# Altium schematic sheet 3.3v通信板.SchDoc
size 381 x 406 mm; SheetNumber: 0; SheetTotal: 0
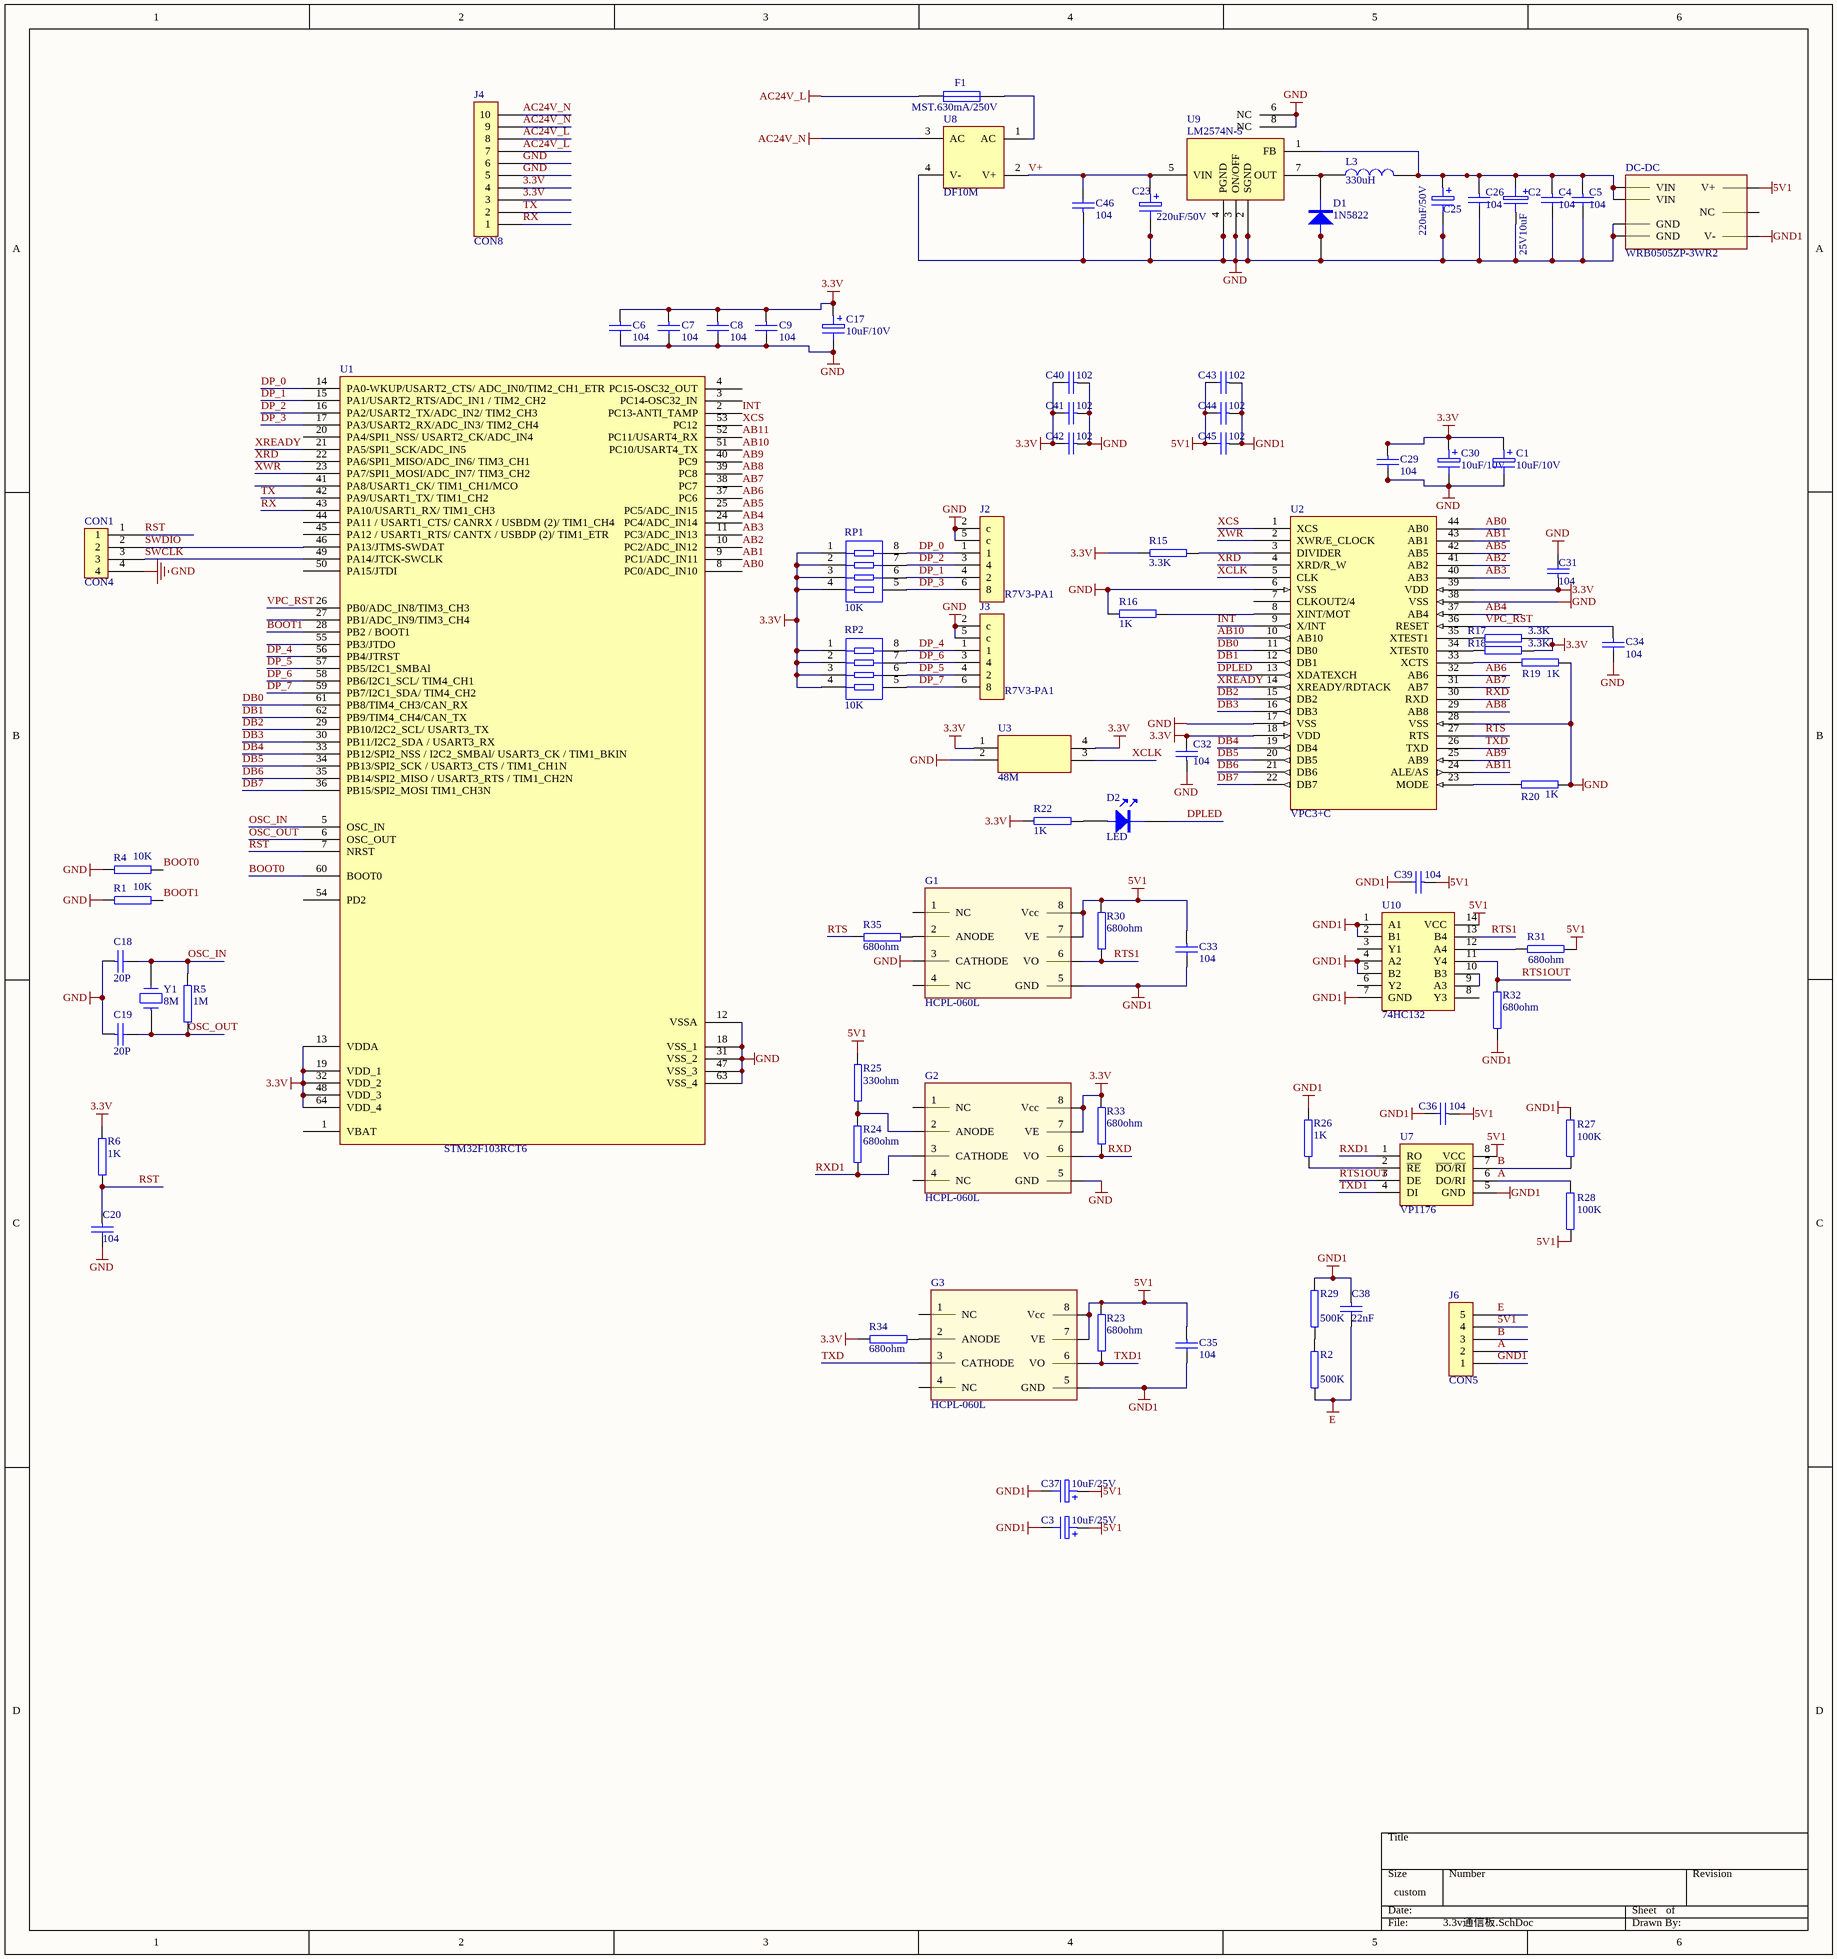
[diagram p0: 3.3v通信板.SchDoc]

## Parts
C1  10uF/10V  [C-坦电容]
C2  25V10uF  [C-坦电容]
C3  10uF/25V  [C-坦电容]
C4  104  [CR0805]
C5  104  [CR0805]
C6  104  [0603]
C7  104  [0603]
C8  104  [0603]
C9  104  [0603]
C17  10uF/10V  [C-坦电容]
C18  20P  [0603]
C19  20P  [0603]
C20  104  [0603]
C23  220uF/50V  [CAP - duplicate]
C25  220uF/50V  [CAP - duplicate]
C26  104  [CR0805]
C29  104  [0603]
C30  10uF/10V  [C-坦电容]
C31  104  [0603]
C32  104  [0603]
C33  104  [0805]
C34  104  [0603]
C35  104  [CR0805]
C36  104  [CR0805]
C37  10uF/25V  [C-坦电容]
C38  22nF  [CAP]
C39  104  [CR0805]
C40  102  [CR0805]
C41  102  [CR0805]
C42  102  [CR0805]
C43  102  [CR0805]
C44  102  [CR0805]
C45  102  [CR0805]
C46  104  [CR0805]
CON1  CON4  [4PIN]
D1  1N5822  [SWDD]
D2  LED  [TLED]
DC-DC  WRB0505ZP-3WR2  [WRB0505ZP-3WR2]
F1  MST.630mA/250V  [RAD0.2]
G1  HCPL-060L  [SO8]
G2  HCPL-060L  [SO8]
G3  HCPL-060L  [SO8]
J2  R7V3-PA1  [R7V3-PA1-CE]
J3  R7V3-PA1  [R7V3-PA1-CE]
J4  CON8  [CON10]
J6  CON5  [3.96-5T]
L3  330uH  [PL]
R1  10K  [0603]
R2  500K  [TGR]
R4  10K  [0603]
R5  1M  [0603]
R6  1K  [0603]
R15  3.3K  [0603]
R16  1K  [0603]
R17  3.3K  [0603]
R18  3.3K  [0603]
R19  1K  [0603]
R20  1K  [0603]
R22  1K  [0603]
R23  680ohm  [CR0805]
R24  680ohm  [CR0805]
R25  330ohm  [CR0805]
R26  1K  [CR0805]
R27  100K  [CR0805]
R28  100K  [CR0805]
R29  500K  [TGR]
R30  680ohm  [CR0805]
R31  680ohm  [CR0805]
R32  680ohm  [CR0805]
R33  680ohm  [CR0805]
R34  680ohm  [CR0805]
R35  680ohm  [CR0805]
RP1  10K  [RESPACK4A]
RP2  10K  [RESPACK4A]
U1  STM32F103RCT6  [LQFP64]
U2  VPC3+C  [VPC3]
U3  48M  [CRYSTAL-48M]
U7  VP1176  [SO8]
U8  DF10M  [BRIGDE_RECTIFIER]
U9  LM2574N-5  [DIP-8]
U10  74HC132  [SO-14]
Y1  8M  [TX]

## Nets
3.3V: C1.1 C6.1 C7.1 C8.1 C9.1 C17.1 C29.1 C30.1 C31.1 C32.2 C40.2 C41.2 C42.2 G2.7(VE) G2.8(Vcc) J4.3 J4.4 R6.2 R15.2 R17.1 R18.1 R22.2 R33.1 R34.1 RP1.1 RP1.2 RP1.3 RP1.4 RP2.1 RP2.2 RP2.3 RP2.4 U1.13(VDDA) U1.19(VDD_1) U1.32(VDD_2) U1.48(VDD_3) U1.64(VDD_4) U2.18(VDD) U2.39(VDD) U3.1 U3.4
5V1: C3.1 C33.1 C35.1 C36.1 C37.1 C39.1 C43.2 C44.2 C45.2 DC-DC.14(V+) G1.7(VE) G1.8(Vcc) G3.7(VE) G3.8(Vcc) J6.4 R23.1 R25.1 R28.1 R30.1 R31.1 U7.8(VCC) U10.14(VCC)
AC24V_L: F1.1 J4.7 J4.8
AC24V_N: J4.9 J4.10 U8.3(AC)
E: C38.2 J6.5 R2.1
GND: C1.2 C2.2 C4.2 C5.2 C6.2 C7.2 C8.2 C9.2 C17.2 C18.1 C19.1 C20.2 C23.2 C25.2 C26.2 C29.2 C30.2 C31.2 C32.1 C34.2 C40.1 C41.1 C42.1 C46.1 CON1.4 D1.1 DC-DC.2(GND) DC-DC.3(GND) G1.3(CATHODE) G2.5(GND) J2.2(c) J2.5(c) J3.2(c) J3.5(c) J4.5 J4.6 R1.2 R4.2 R16.2 R19.1 R20.1 U1.12(VSSA) U1.18(VSS_1) U1.31(VSS_2) U1.47(VSS_3) U1.63(VSS_4) U2.6(VSS) U2.17(VSS) U2.28(VSS) U2.38(VSS) U3.2 U8.4(V-) U9.2(SGND) U9.3(ON/OFF) U9.4(PGND) U9.6(NC) U9.8(NC)  [also labelled NC]
GND1: C3.2 C33.2 C35.2 C36.2 C37.2 C38.1 C39.2 C43.1 C44.1 C45.1 DC-DC.16(V-) G1.5(GND) G3.5(GND) J6.1 R26.2 R27.2 R29.2 R32.1 U7.5(GND) U10.1(A1) U10.2(B1) U10.4(A2) U10.5(B2) U10.7(GND)
A: J6.2 R28.2 U7.6(DO/RI)
AB0: U1.8(PC0/ADC_IN10) U2.44(AB0)
AB1: U1.9(PC1/ADC_IN11) U2.43(AB1)
AB2: U1.10(PC2/ADC_IN12) U2.41(AB2)
AB3: U1.11(PC3/ADC_IN13) U2.40(AB3)
AB4: U1.24(PC4/ADC_IN14) U2.37(AB4)
AB5: U1.25(PC5/ADC_IN15) U2.42(AB5)
AB6: U1.37(PC6) U2.32(AB6)
AB7: U1.38(PC7) U2.31(AB7)
AB8: U1.39(PC8) U2.29(AB8)
AB9: U1.40(PC9) U2.25(AB9)
AB10: U1.51(PC10/USART4_TX) U2.10(AB10)
AB11: U1.52(PC11/USART4_RX) U2.24(ALE/AS)
B: J6.3 R27.1 U7.7(~{DO}/~{RI})
BOOT0: R4.1 U1.60(BOOT0)
BOOT1: R1.1 U1.28(PB2_/_BOOT1)
DB0: U1.61(PB8/TIM4_CH3/CAN_RX) U2.11(DB0)
DB1: U1.62(PB9/TIM4_CH4/CAN_TX) U2.12(DB1)
DB2: U1.29(PB10/I2C2_SCL/
USART3_TX) U2.15(DB2)
DB3: U1.30(PB11/I2C2_SDA_/
USART3_RX) U2.16(DB3)
DB4: U1.33(PB12/SPI2_NSS_/
I2C2_SMBAl/
USART3_CK_/
TIM1_BKIN) U2.19(DB4)
DB5: U1.34(PB13/SPI2_SCK_/
USART3_CTS_/
TIM1_CH1N) U2.20(DB5)
DB6: U1.35(PB14/SPI2_MISO_/
USART3_RTS_/
TIM1_CH2N) U2.21(DB6)
DB7: U1.36(PB15/SPI2_MOSI
TIM1_CH3N) U2.22(DB7)
DP_0: J2.1 RP1.8 U1.14(PA0-WKUP/USART2_CTS/
ADC_IN0/TIM2_CH1_ETR)
DP_1: J2.4(2) RP1.6 U1.15(PA1/USART2_RTS/ADC_IN1
/
TIM2_CH2)
DP_2: J2.3(4) RP1.7 U1.16(PA2/USART2_TX/ADC_IN2/
TIM2_CH3)
DP_3: J2.6(8) RP1.5 U1.17(PA3/USART2_RX/ADC_IN3/
TIM2_CH4)
DP_4: J3.1 RP2.8 U1.56(PB4/JTRST)
DP_5: J3.4(2) RP2.6 U1.57(PB5/I2C1_SMBAl)
DP_6: J3.3(4) RP2.7 U1.58(PB6/I2C1_SCL/
TIM4_CH1)
DP_7: J3.6(8) RP2.5 U1.59(PB7/I2C1_SDA/
TIM4_CH2)
DPLED: D2.K U2.13(XDATEXCH)
INT: U1.2(PC13-ANTI_TAMP) U2.9(X/INT)
OSC_IN: C18.2 R5.1 U1.5(OSC_IN) Y1.2
OSC_OUT: C19.2 R5.2 U1.6(OSC_OUT) Y1.1
RST: C20.1 CON1.1 R6.1 U1.7(NRST)
RTS: R35.1 U2.27(RTS)
RTS1: G1.6(VO) R30.2 U10.13(B4)
RTS1OUT: R32.2 U7.3(DE) U10.11(Y4)
RX: J4.1 U1.43(PA10/USART1_RX/
TIM1_CH3)
RXD: G2.6(VO) R33.2 U2.30(RXD)
RXD1: G2.3(CATHODE) R24.1 U7.1(RO)
SWCLK: CON1.3 U1.49(PA14/JTCK-SWCLK)
SWDIO: CON1.2 U1.46(PA13/JTMS-SWDAT)
TX: J4.2 U1.42(PA9/USART1_TX/
TIM1_CH2)
TXD: G3.3(CATHODE) U2.26(TXD)
TXD1: G3.6(VO) R23.2 U7.4(DI)
V+: C23.1 C46.2 U8.2(V+) U9.5(VIN)
VPC_RST: C34.1 U1.26(PB0/ADC_IN8/TIM3_CH3) U2.36(RESET)
XCLK: U2.5(CLK) U3.3
XCS: U1.53(PC12) U2.1(XCS)
XRD: U1.22(PA6/SPI1_MISO/ADC_IN6/
TIM3_CH1) U2.4(XRD/R_W)
XREADY: U1.21(PA5/SPI1_SCK/ADC_IN5) U2.14(XREADY/RDTACK)
XWR: U1.23(PA7/SPI1_MOSI/ADC_IN7/
TIM3_CH2) U2.2(XWR/E_CLOCK)
NetC2_1: C2.1 C4.1 C5.1 C25.1 C26.1 DC-DC.22(VIN) DC-DC.23(VIN) L3.2 U9.1(FB)
NetD1_2: D1.2 L3.1 U9.7(OUT)
NetD2_A: D2.A R22.1
NetF1_2: F1.2 U8.1(AC)
NetG1_2: G1.2(ANODE) R35.2
NetG2_2: G2.2(ANODE) R24.2 R25.2
NetG3_2: G3.2(ANODE) R34.2
NetR2_2: R2.2 R29.1
NetR15_1: R15.1 U2.3(DIVIDER)
NetR16_1: R16.1 U2.8(XINT/MOT)
NetR17_2: R17.2 U2.35(XTEST1)
NetR18_2: R18.2 U2.34(XTEST0)
NetR19_2: R19.2 U2.33(XCTS)
NetR20_2: R20.2 U2.23(MODE)
NetR26_1: R26.1 U7.2(~{RE})
NetR31_2: R31.2 U10.12(A4)
NetU10_9: U10.9(A3) U10.10(B3)

Not connected (* = marked no-connect by the designer): DC-DC 11(NC); G1 1(NC) 4(NC); G2 1(NC) 4(NC); G3 1(NC) 4(NC); U1 1(VBAT) 3(PC14-OSC32_IN) 4(PC15-OSC32_OUT) 20(PA4/SPI1_NSS/
USART2_CK/ADC_IN4) 27(PB1/ADC_IN9/TIM3_CH4) 41(PA8/USART1_CK/
TIM1_CH1/MCO) 44(PA11_/_USART1_CTS/
CANRX_/_USBDM_(2)/
TIM1_CH4) 45(PA12_/_USART1_RTS/
CANTX_/_USBDP_(2)/
TIM1_ETR) 50(PA15/JTDI) 54(PD2) 55(PB3/JTDO); U2 7(CLKOUT2/4); U10 3(Y1) 6(Y2) 8(Y3)

## Library data of the parts
C1 C3 C17 C23 C25 C30 C37 = ELECTRO1: Electrolytic Capacitor
C2 = CAPACITOR POL: CA45-?V?uF ABCD 16V10UF[A型3210]16V22UF(B型1210) 16V47UF(C型1812)
C4-C9 C18-C20 C26 C29 C31-C36 C38-C46 = CAP: Capacitor
D1 = DIODE-A: (1N4007贴片) M7
F1 = FUSE1: Fuse
J2 J3 = R7V3-PA1-CE
J4 = CON8: Connector
J6 = CON5: Connector
L3 = INDUCTOR
R1 R2 R4-R6 R15-R20 R22-R35 = RES2
RP1 RP2 = RESPACK4A
U1 = STM32F103R
U7 = DS75176
U8 = BRIDGE2: Diode Bridge
U9 = LM2574N
Y1 = CRYSTAL